# EAGLE design Core-Wemos (EAGLE 7.7.0)
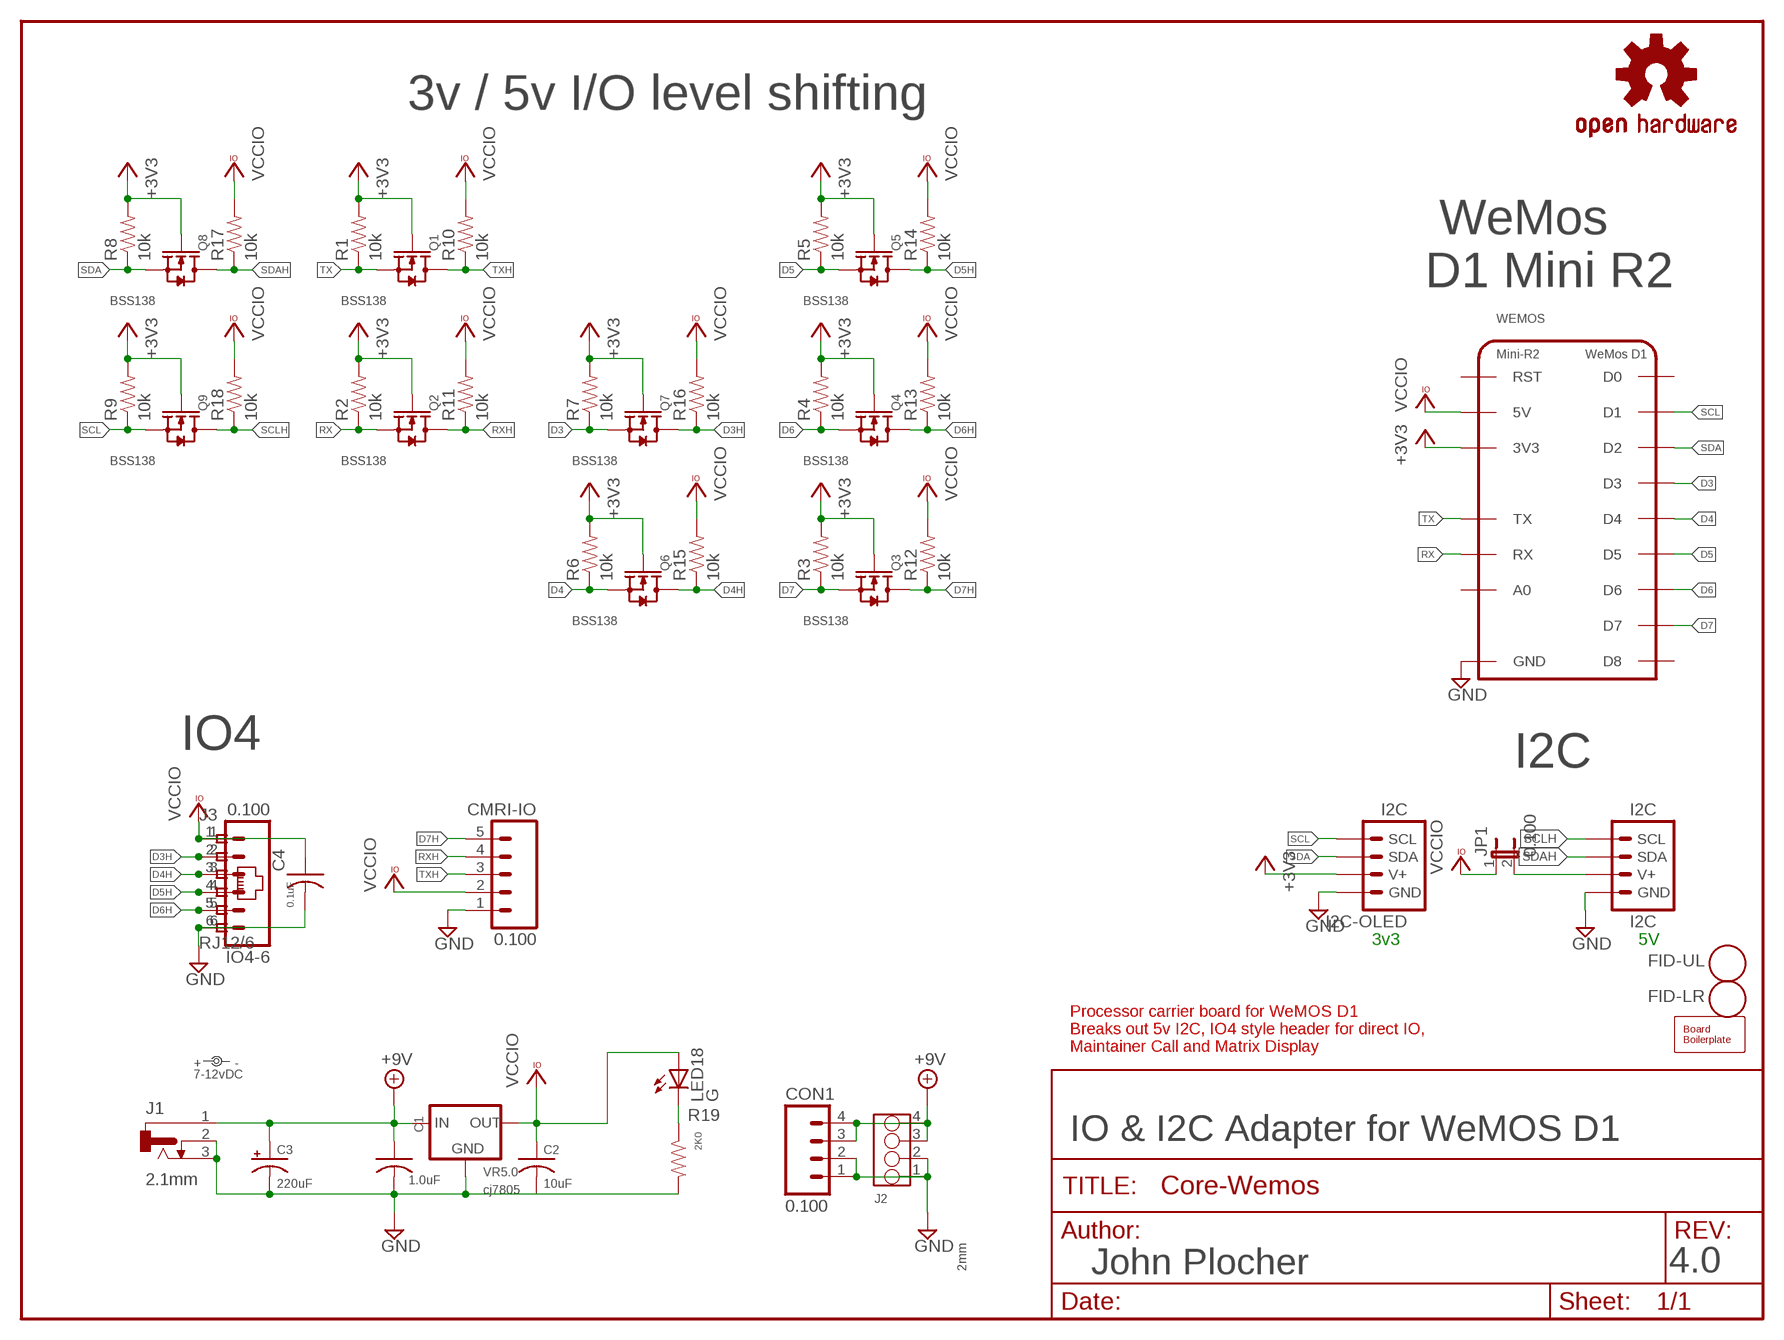
[diagram p0: schematic, sheet 1]

## Parts
BOARD  BOARD  BOARD80X80-NOHOLES  [BOARD-DINRAIL-3.17INX8CM-NOHOLES]
C1  1.0uF  CAP0603  [0603-CAP]
C2  10uF  CAP0603  [0603-CAP]
C3  220uF  CAP-POL0810  [0810-CAP]
C4  0.1uF  CAP0603  [0603-CAP]
CMRI-IO  0.100  CONNECTOR-M05CMRI  [1X05-CMRI-IO]
CON1  0.100  CONNECTOR-M04LOCK  [1X04_LOCK]
FID-LR  FIDUCIAL  [FIDUCIAL_1MM]
FID-UL  FIDUCIAL  [FIDUCIAL_1MM]
I2C  I2C  CONNECTOR-I2CLEFT  [I2C-L]
I2C-OLED  I2C  CONNECTOR-I2CNOOUTLINE  [I2C-NOOUTLINE]
IO4-6  0.100  CONNECTOR-M06LOCK  [1X06_LOCK]
J1  2.1mm  CONNECTOR-DC-POWER-RA  [DCJ0202]
J2  2mm  CONNECTOR-GROVE-4P-2.0-3470130P1  [4P-2.0]
J3  RJ12/6  CONNECTOR-RJ25-6P6C  [RJ25-PANEL]
JP1  0.100  JUMPER-2PTH_LOCK  [1X02_LOCK]
LABEL1  7-12vDC  DOC-POWER_LABEL  [PWR_LABEL]
LED18  G  LED0603-LED  [0603-LED]
OSHW1  OSHW  OSHW-LOGOL  [OSHW-LOGO-L]
Q1  BSS138  MOSFET-N-BSS138-SOT23  [SOT23]
Q2  BSS138  MOSFET-N-BSS138-SOT23  [SOT23]
Q3  BSS138  MOSFET-N-BSS138-SOT23  [SOT23]
Q4  BSS138  MOSFET-N-BSS138-SOT23  [SOT23]
Q5  BSS138  MOSFET-N-BSS138-SOT23  [SOT23]
Q6  BSS138  MOSFET-N-BSS138-SOT23  [SOT23]
Q7  BSS138  MOSFET-N-BSS138-SOT23  [SOT23]
Q8  BSS138  MOSFET-N-BSS138-SOT23  [SOT23]
Q9  BSS138  MOSFET-N-BSS138-SOT23  [SOT23]
R1  10k  R0603-RES  [0603-RES]
R2  10k  R0603-RES  [0603-RES]
R3  10k  R0603-RES  [0603-RES]
R4  10k  R0603-RES  [0603-RES]
R5  10k  R0603-RES  [0603-RES]
R6  10k  R0603-RES  [0603-RES]
R7  10k  R0603-RES  [0603-RES]
R8  10k  R0603-RES  [0603-RES]
R9  10k  R0603-RES  [0603-RES]
R10  10k  R0603-RES  [0603-RES]
R11  10k  R0603-RES  [0603-RES]
R12  10k  R0603-RES  [0603-RES]
R13  10k  R0603-RES  [0603-RES]
R14  10k  R0603-RES  [0603-RES]
R15  10k  R0603-RES  [0603-RES]
R16  10k  R0603-RES  [0603-RES]
R17  10k  R0603-RES  [0603-RES]
R18  10k  R0603-RES  [0603-RES]
R19  2K0  R0603-RES  [0603-RES]
VR5.0  cj7805  VREG-DPAK-5  [TO-252]
WEMOS  Mini-R2  WEMOS-D1V1  [WEMOS-D1]

## Nets
+3V3: I2C-OLED.V+ Q1.1(G) Q2.1(G) Q3.1(G) Q4.1(G) Q5.1(G) Q6.1(G) Q7.1(G) Q8.1(G) Q9.1(G) R1.2 R2.2 R3.2 R4.2 R5.2 R6.2 R7.2 R8.2 R9.2 WEMOS.3V3
+9V [Feed]: C1.1 C3.+ CON1.3 CON1.4 J1.1 J2.3 J2.4 VR5.0.1(IN)
D3 [signals]: Q7.2(S) R7.1 WEMOS.D3
D3H [signals]: IO4-6.2 J3.2 Q7.3(D) R16.1
D4 [signals]: Q6.2(S) R6.1 WEMOS.D4
D4H [signals]: IO4-6.3 J3.3 Q6.3(D) R15.1
D5 [signals]: Q5.2(S) R5.1 WEMOS.D5
D5H [signals]: IO4-6.4 J3.4 Q5.3(D) R14.1
D6 [signals]: Q4.2(S) R4.1 WEMOS.D6
D6H [signals]: IO4-6.5 J3.5 Q4.3(D) R13.1
D7 [signals]: Q3.2(S) R3.1 WEMOS.D7
D7H [signals]: CMRI-IO.5 Q3.3(D) R12.1
GND [signals]: C1.2 C2.2 C3.- C4.2 CMRI-IO.1 CON1.1 CON1.2 I2C-OLED.GND I2C.GND I2C.GND@1(GND) IO4-6.6 J1.2 J1.3 J2.1 J2.2 J3.6 VR5.0.2(GND) WEMOS.GND
GND1 [Power]: R19.2
N$1: LED18.C R19.1
N$44: I2C.V+ I2C.V+@1(V+) JP1.2
RX [signals]: Q2.2(S) R2.1 WEMOS.RX
RXH [signals]: CMRI-IO.4 Q2.3(D) R11.1
SCL [signals]: I2C-OLED.SCL Q9.2(S) R9.1 WEMOS.D1
SCLH [signals]: I2C.SCL I2C.SCL@1(SCL) Q9.3(D) R18.1
SDA [signals]: I2C-OLED.SDA Q8.2(S) R8.1 WEMOS.D2
SDAH [signals]: I2C.SDA I2C.SDA@1(SDA) Q8.3(D) R17.1
TX [signals]: Q1.2(S) R1.1 WEMOS.TX
TXH [signals]: CMRI-IO.3 Q1.3(D) R10.1
VCCIO [Power]: C2.1 C4.1 CMRI-IO.2 IO4-6.1 J3.1 JP1.1 LED18.A R10.2 R11.2 R12.2 R13.2 R14.2 R15.2 R16.2 R17.2 R18.2 VR5.0.3(OUT) WEMOS.5V
Unconnected: WEMOS.A0 WEMOS.D0 WEMOS.D8 WEMOS.RST

## Notes on the sheet
- 3v / 5v I/O level shifting
- WeMos
  D1 Mini R2
- IO4
- I2C
- 3v3 | 5V
- Processor carrier board for WeMOS D1
  Breaks out 5v I2C, IO4 style header for direct IO,
  Maintainer Call and Matrix Display
- IO & I2C Adapter for WeMOS D1
- John Plocher | 4.0

## Library data of the parts
BOARD = SPCoast:BOARD
C1 C2 C4 = SPCoast:CAP*
C3 = SPCoast:CAP-POL*
CMRI-IO = SPCoast:CONNECTOR-M05: Header 5 Standard 5-pin 0.1" header. Use with straight break away headers (SKU : PRT-00116), right angle break away headers (PRT-00553), swiss pins (PRT-00743), machine pins (PRT-00117), and female headers (PRT-00115). Molex polarized connector foot print use with SKU : PRT-08230 with associated crimp pins and housings.
CON1 = SPCoast:CONNECTOR-M04: Header 4 Standard 4-pin 0.1" header. Use with straight break away headers (SKU : PRT-00116), right angle break away headers (PRT-00553), swiss pins (PRT-00743), machine pins (PRT-00117), and female headers (PRT-00115). Molex polarized connector foot print use with SKU : PRT-08231 with associated crimp pins and housings. 1MM SMD Version SKU: PRT-10208
FID-LR FID-UL = SPCoast:FIDUCIAL: For use by pick and place machines to calibrate the vision/machine, 1mm By microbuilder.eu
I2C I2C-OLED = SPCoast:CONNECTOR-I2C
IO4-6 = SPCoast:CONNECTOR-M06: Header 6 Standard 6-pin 0.1" header
J1 = SPCoast:CONNECTOR-DC-POWER: DC POWER JACK
J2 = SPCoast:CONNECTOR-GROVE-4P-2.0
J3 = SPCoast:CONNECTOR-RJ25: AMP connector; AMP: 520250-3; OPL: none
JP1 = SPCoast:JUMPER-2: Jumper Basic 0.1" spaced jumper. Use with breakaway headers.
LABEL1 = SPCoast:DOC-POWER_LABEL
LED18 = SPCoast:LED*
OSHW1 = SparkFun:OSHW-LOGO: Open Source Hardware Logo This logo indicates the piece of hardware it is found on incorporates a OSHW license and/or adheres to the definition of open source hardware found here: http://freedomdefined.org/OSHW
Q1-Q9 = SPCoast:MOSFET-N-*-?: CJ2302：SMD MOSFET N-CH 20V-2.1A DMN4468 - SO8 30v/10A
R1-R19 = SPCoast:R*: Resistor Basic schematic elements and footprints for 0603, 1206, and PTH 1/10th watt (small) resistors.
VR5.0 = SPCoast:VREG-?-*: Voltage Regulator Standard linear regulator. 7805 uses IGO pinout LM1117 uses GOI pinout
WEMOS = SPCoast:WEMOS-D1

## Net classes
0 default: width 0.254 mm, drill 0.5 mm, clearance 0.203 mm
1 Power: width 0.406 mm, drill 0.8 mm, clearance 0.254 mm
2 signals: width 0.254 mm, drill 0.6 mm, clearance 0.254 mm
3 Feed: width 1.016 mm, drill 1.4 mm, clearance 0.254 mm

## Board
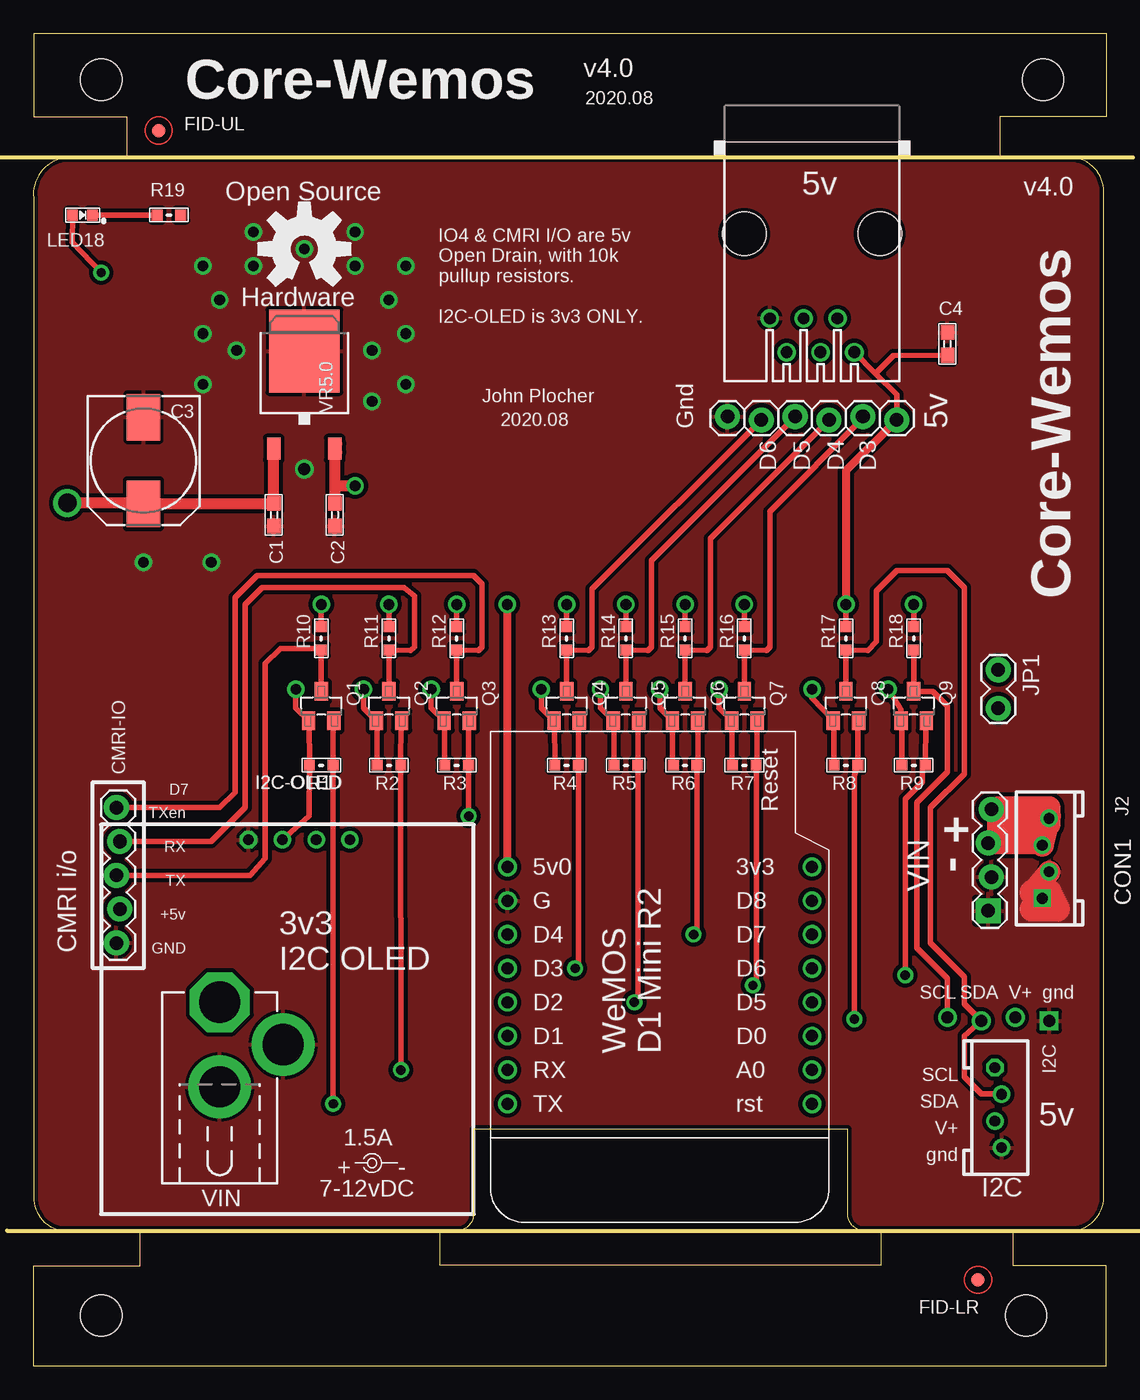
[diagram p1: board, top side]
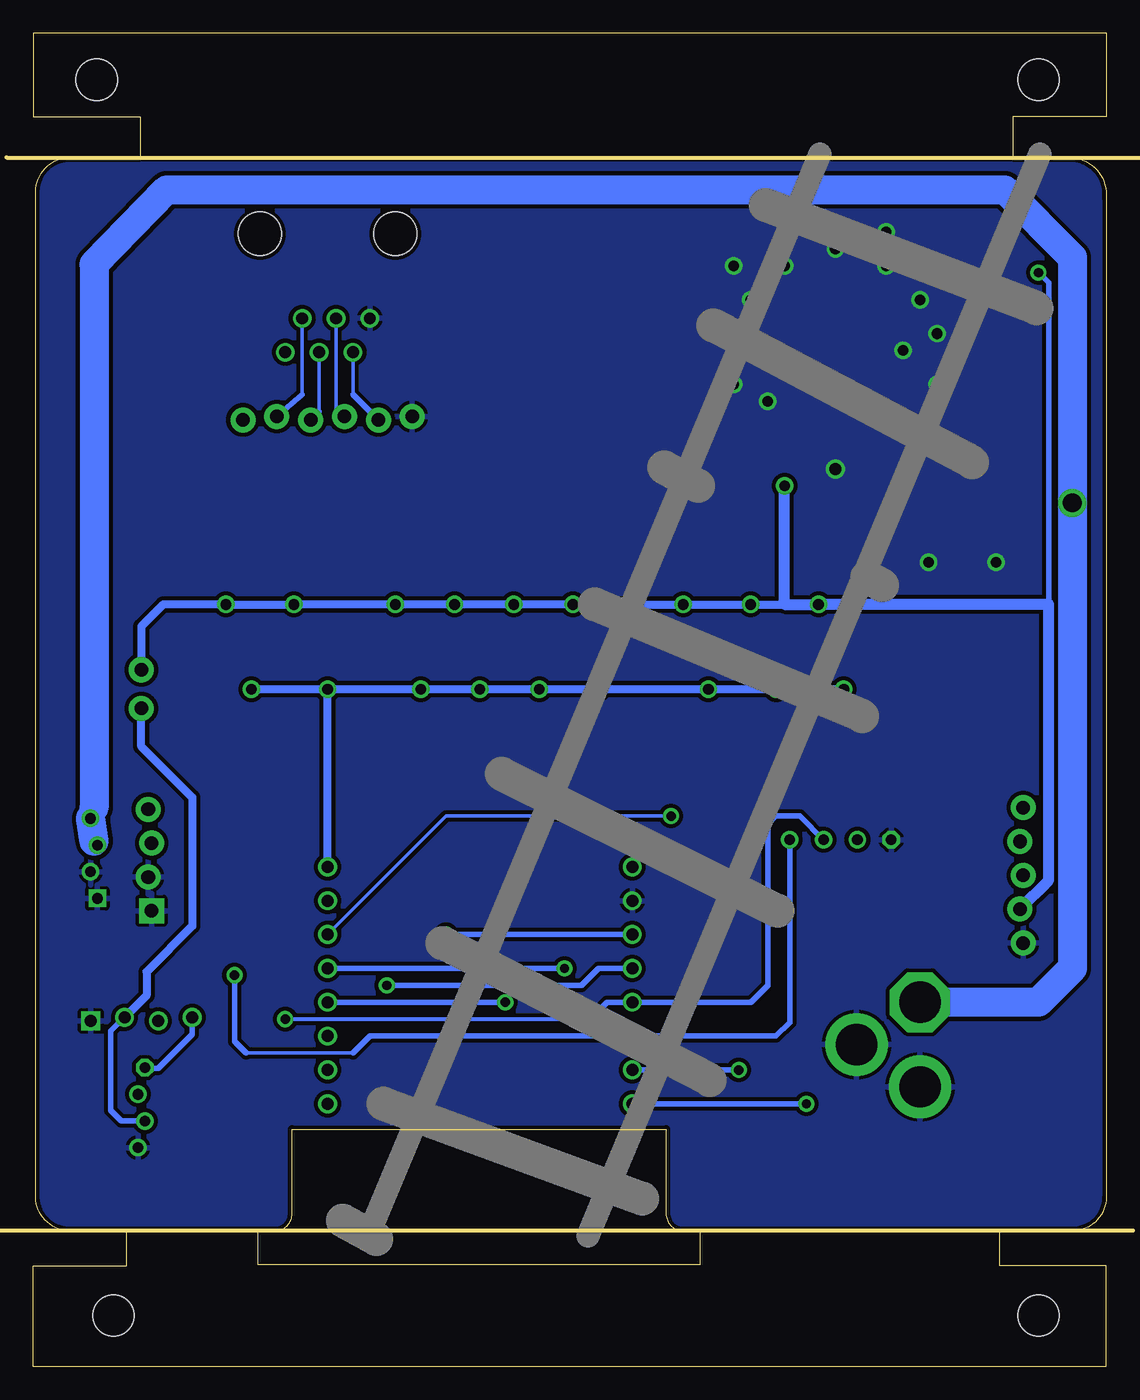
[diagram p2: board, bottom side, seen from below]

Size 80.51 x 100 mm. Coordinates in mm from the lower left corner, seen from the top.
Outline: 33.03,17.78 33.03,11.43 arc-90 31.76,10.16 30.49,10.16 30.49,7.62 63.64,7.62 63.64,10.16 62.37,10.16 arc-90 61.1,11.43 61.1,17.78 33.03,17.78
Copper layers (1*16): Top 0.035mm / dielectric 1.5mm / Bottom 0.035mm
Design rules "Fusion_eagle_rule_v1.1 *": minimum track width 8mil, minimum drill 0.6mm, track to track 6mil, track to pad 6mil, pad to pad 10mil, via to via 10mil, smd to smd 10mil, copper to edge 10mil, drill to drill 10mil, minimum pad ring 10mil, minimum via ring 10mil, stop-mask expansion 2mil, vias tented up to drill 100mil, thermal gap 10mil

### Footprints (pad centres in the part's own frame; a part is rotated, then mirrored left to right if it is on the bottom)
BOARD-DINRAIL-3.17INX8CM-NOHOLES = hole 3.1: 5.08,96.52; 75.75,96.52; 5.08,3.81; 74.48,3.81
0603-CAP = smd 1.1 x 1: 1 -0.85,0; 2 0.85,0
0810-CAP = smd 3.5 x 2.5: + 3.25,0; - -3.25,0
1X05-CMRI-IO = drill 1.016 pad 1.88: 1 0,0.127; 2 2.54,-0.127; 3 5.08,0.127; 4 7.62,-0.127; 5 10.16,0.127
1X04_LOCK = drill 1.016 pad 1.88 square: 1 0,0.127 | drill 1.016 pad 1.88: 2 2.54,-0.127; 3 5.08,0.127; 4 7.62,-0.127
FIDUCIAL_1MM = smd 1 x 1: 1 0,0
I2C-L = drill 0.9 square: GND 3.81,-0.127 | drill 0.8 pad 1.27: GND@1 0.254,-9.635; SDA@1 0.254,-5.635; V+@1 -0.254,-7.635 | drill 0.9: SCL -3.81,0.127; SDA -1.27,-0.127; V+ 1.27,0.127 | drill 0.8 pad 1.27 octagon: SCL@1 -0.254,-3.635
I2C-NOOUTLINE = drill 0.8 octagon: GND 3.81,0 | drill 0.8: SCL -3.81,0; SDA -1.27,0; V+ 1.27,0
1X06_LOCK = drill 1.016 pad 1.88: 1 0,0; 2 2.54,-0.254; 3 5.08,0; 4 7.62,-0.254; 5 10.16,0; 6 12.7,-0.254
DCJ0202 = drill 3.1 pad 4.5 octagon: 1 0,3.175 | drill 3.1 pad 4.7: 2 4.763,0; 3 0,-3.175
4P-2.0 = drill 0.8 pad 1.27 square: 1 -3,0.254 | drill 0.8 pad 1.27: 2 -1,-0.254; 3 1,0.254; 4 3,-0.254
RJ25-PANEL = drill 0.889: 1 -3.175,8.89; 2 -1.905,6.35; 3 -0.635,8.89; 4 0.635,6.35; 5 1.905,8.89; 6 3.175,6.35 | hole 3.251: -5.08,0; 5.08,0
1X02_LOCK = drill 1.016 pad 1.88: 1 -0.178,0; 2 2.718,0
0603-LED = smd 0.8 x 0.8: A 0.75,0; C -0.75,0
SOT23 = smd 1.4 x 1: 1 1.1,-0.95; 2 1.1,0.95; 3 -1.1,0
0603-RES = smd 0.813 x 0.813: 1 -0.889,0; 2 0.889,0
TO-252 = smd 1.651 x 1.016: 1 -4.826,2.286; 3 -4.826,-2.286 | smd 6.2 x 5.3: 2 2.5,0
WEMOS-D1 = drill 0.9: 3V3 -11.43,-7.62; 5V 11.43,-7.62; A0 -11.43,7.62; D0 -11.43,5.08; D1 11.43,5.08; D2 11.43,2.54; D3 11.43,0; D4 11.43,-2.54; D5 -11.43,2.54; D6 -11.43,0; D7 -11.43,-2.54; D8 -11.43,-5.08; GND 11.43,-5.08; RST -11.43,10.16; RX 11.43,7.62; TX 11.43,10.16

### Placement (x,y rotation side)
BOARD  0.01,0 0 top
C1  18.05,63.88 270 top
C2  22.62,63.88 270 top
C3  8.27,67.94 270 top
C4  68.59,76.71 90 top
CMRI-IO  6.36,31.75 90 top
CON1  71.77,34.16 90 top
FID-LR  70.88,6.48 0 top
FID-UL  9.41,92.71 0 top
I2C  72.4,26.04 0 top
I2C-OLED  19.95,39.5 180 top
IO4-6  64.78,70.99 180 top
J1  13.98,24.13 0 top
J2  75.96,38.1 90 top
J3  58.43,84.96 180 top
JP1  72.4,52.07 270 top
LABEL1  25.41,15.24 90 top
LED18  3.7,86.36 180 top
OSHW1  20.33,83.82 0 top
Q1  21.6,49.53 270 top
Q2  26.68,49.53 270 top
Q3  31.76,49.53 270 top
Q4  40.02,49.53 270 top
Q5  44.46,49.53 270 top
Q6  48.91,49.53 270 top
Q7  53.35,49.53 270 top
Q8  60.97,49.53 270 top
Q9  66.05,49.53 270 top
R1  21.6,45.09 180 top
R2  26.68,45.09 180 top
R3  31.76,45.09 180 top
R4  40.02,45.09 180 top
R5  44.46,45.09 180 top
R6  48.91,45.09 180 top
R7  53.35,45.09 180 top
R8  60.97,45.09 180 top
R9  66.05,45.09 180 top
R10  21.6,54.61 90 top
R11  26.68,54.61 90 top
R12  31.76,54.61 90 top
R13  40.02,54.61 90 top
R14  44.46,54.61 90 top
R15  48.91,54.61 90 top
R16  53.35,54.61 90 top
R17  60.97,54.61 90 top
R18  66.05,54.61 90 top
R19  10.17,86.36 0 top
VR5.0  20.33,73.66 90 top
WEMOS  47,29.84 180 top

### Tracks (layer width: path | path; a pad name or v marks a point on that pad's centre or on a via)
+3V3  (via drill 0.8)
  Top 0.254: 20.7,48.38 Q1.1 | 25.78,48.38 Q2.1 | 30.86,48.38 Q3.1 | 60.07,48.38 Q8.1 | 65.15,48.38 Q9.1
  Top 0.406: R6.2 47.96,45.13 Q6.1 47,49.38 v47,50.8 | R7.2 52.4,45.13 Q7.1 51.45,49.38 v51.45,50.8 | 20.7,48.38 R1.2 20.7,41.29 I2C-OLED.V+ | R2.2 25.78,48.38 | R3.2 30.86,48.38 | R4.2 39.12,48.38 Q4.1 38.11,49.38 v38.11,50.8 | R5.2 43.56,48.38 Q5.1 42.56,49.38 v42.56,50.8 | R8.2 60.07,48.38 | R9.2 65.15,48.38 | Q1.1 19.7,49.38 v19.7,50.8 | Q2.1 24.78,49.38 v24.78,50.8 | Q3.1 29.86,49.38 v29.86,50.8 | Q8.1 58.43,50.15 v58.43,50.8 | Q9.1 65.09,49.28 v64.15,50.8
  Bottom 0.61: v64.15,50.8 v58.43,50.8 | v19.7,50.8 v24.78,50.8 v29.86,50.8 v38.11,50.8 v42.56,50.8 v47,50.8 v51.45,50.8 v58.43,50.8 | WEMOS.3V3 v58.43,50.8
+9V  (via drill 1.4)
  Top 0.61: C3.+ 8.19,64.77 | 18.05,64.69 C1.1
  Top 0.813: 18.05,64.69 C3.+ | 8.19,64.77 v2.55,64.77 | C1.1 VR5.0.1
  Top 1.676: CON1.3 72.4,39.24 | 72.4,39.24 75.71,39.24 J2.3 | CON1.4 72.4,41.78 | 72.4,41.78 72.4,39.24 | 72.4,41.78 73.67,41.78 73.67,40.64 76.21,40.64 76.21,41.91 72.4,41.91
  Top 1.778: J2.3 76.21,41.27
  Bottom 1.016: 75.96,39.37 J2.3
  Bottom 1.422: 75.96,41.91 76.09,41.78 J2.4
  Bottom 2.184: 75.96,39.37 J2.4 | J1.1 5.09,27.3 2.55,29.84 v2.55,64.77 2.55,83.19 7.63,88.27 70.5,88.27 75.96,82.68 75.96,41.91
D3  (via drill 0.7)
  Top 0.406: Q7.2 54.3,45.13 R7.1 54.25,28.84 v53.99,28.57
  Bottom 0.406: WEMOS.D3 38.11,29.84 39.38,28.57 v53.99,28.57
D3H
  Top 0.406: Q7.3 R16.1 54.99,53.71 55.26,53.98 55.26,64.14 62.24,71.12 IO4-6.2
  Bottom 0.254: J3.2 60.34,72.9
  Bottom 0.406: 60.34,72.9 IO4-6.2
D4  (via drill 0.7)
  Top 0.406: Q6.2 49.86,45.13 R6.1 49.81,32.65 v49.54,32.38
  Bottom 0.406: WEMOS.D4 v49.54,32.38
D4H
  Top 0.406: Q6.3 R15.1 50.55,53.71 50.81,53.98 50.81,62.1 IO4-6.3
  Bottom 0.254: J3.3 59.07,71.63
  Bottom 0.406: 59.07,71.63 IO4-6.3
D5  (via drill 0.7)
  Top 0.406: Q5.2 45.36,48.38 R5.1 45.36,27.57 v45.1,27.3
  Bottom 0.406: WEMOS.D5 v45.1,27.3
D5H
  Top 0.406: Q5.3 R14.1 46.1,53.71 46.37,53.98 46.37,60.45 IO4-6.4
  Bottom 0.254: J3.4 57.8,71.63
  Bottom 0.406: 57.8,71.63 IO4-6.4
D6  (via drill 0.7)
  Top 0.406: Q4.2 40.92,48.38 R4.1 40.92,30.11 v40.65,29.84
  Bottom 0.406: WEMOS.D6 v40.65,29.84
D6H
  Top 0.406: Q4.3 R13.1 41.66,53.71 41.92,53.98 41.92,58.29 IO4-6.5
  Bottom 0.254: J3.5 56.53,72.9
  Bottom 0.406: 56.53,72.9 IO4-6.5
D7  (via drill 0.7)
  Top 0.254: 32.66,48.38 Q3.2
  Top 0.406: 32.66,48.38 R3.1 v32.66,41.27
  Bottom 0.254: WEMOS.D7 49.54,41.27 v32.66,41.27
D7H
  Top 0.406: Q3.3 R12.1 33.4,53.71 33.67,53.98 33.67,58.67 33.03,59.31 16.78,59.31 15.13,57.66 15.13,43.05 13.98,41.91 CMRI-IO.5
GND  (via drill 0.8, 0.9)
  Top 1.676: J2.2 74.94,35.56
  Top 1.93: 74.94,35.56 76.21,35.56 76.85,34.29 74.94,34.29
  other vias: 25.41,72.39 25.41,76.2 26.68,80.01 15.25,76.2 13.98,80.01 24.14,85.09 16.52,85.09 27.95,77.47 12.71,77.47 27.95,73.66 12.71,82.55 27.95,82.55 16.52,82.55 24.14,82.55 20.33,83.82 12.71,73.66 8.27,60.33 13.35,60.33 20.33,67.31
  pour Bottom (isolate 0.305, rank 2): 81.29,10.67 81.29,90.17 0.01,90.17 0.01,10.67 33.03,10.67 33.03,17.78 61.1,17.78 61.1,10.67
  pour Top (isolate 0.305, rank 2): 81.29,10.67 81.29,90.17 0.01,90.17 0.01,10.67 33.03,10.67 33.03,17.78 61.1,17.78 61.1,10.67
N$1
  Top 0.406: LED18.C R19.1
N$44
  Bottom 0.406: I2C.V+ 74.69,25.15 74.69,19.18 73.91,18.4 I2C.V+@1
  Bottom 0.61: I2C.V+ 72.02,27.81 72.02,29.59 68.59,33.02 68.59,42.67 72.4,46.48 JP1.2
RX  (via drill 0.7)
  Top 0.254: 27.58,48.38 Q2.2
  Top 0.406: 27.58,48.38 R2.1 v27.58,22.23
  Bottom 0.406: WEMOS.RX v27.58,22.23
RXH
  Top 0.406: Q2.3 R11.1 28.32,53.71 28.59,53.98 28.59,57.78 27.83,58.42 17.16,58.42 15.89,57.15 15.89,41.91 13.35,39.37 CMRI-IO.4
SCL  (via drill 0.7)
  Top 0.254: 66.95,48.38 Q9.2
  Top 0.406: 66.95,48.38 R9.1 66.69,45.09 66.69,43.81 65.42,42.55 v65.42,29.34
  Bottom 0.254: 56.53,23.5 64.53,23.5
  Bottom 0.406: 56.53,23.5 55.26,24.77 WEMOS.D1 24.78,24.77 23.76,25.78 I2C-OLED.SCL | 64.53,23.5 65.42,24.38 v65.42,29.34
SCLH
  Top 0.254: 68.47,26.16 I2C.SCL
  Top 0.406: R18.1 Q9.3 67.49,50.63 68.59,49.53 68.59,44.58 66.31,42.29 66.31,31.37 68.59,29.08 68.59,26.42 68.47,26.16
  Bottom 0.406: I2C.SCL 68.59,24.89 71.13,22.35 72.1,22.35 I2C.SCL@1
SDA  (via drill 0.7)
  Top 0.254: 61.87,48.38 Q8.2
  Top 0.406: 61.87,48.38 R8.1 61.61,44.33 v61.61,26.04
  Bottom 0.254: WEMOS.D2 36.08,27.3
  Bottom 0.305: 38.75,26.04 v61.61,26.04
  Bottom 0.406: 38.75,26.04 37.48,27.3 36.08,27.3 26.68,27.3 25.41,28.57 25.41,40.64 24.78,41.27 23,41.27 I2C-OLED.SDA
SDAH
  Top 0.406: Q8.3 R17.1 62.61,53.71 63.26,54.36 63.26,58.17 64.78,59.69 68.59,59.69 69.86,58.42 69.86,44.45 67.32,41.91 67.32,31.75 69.86,29.21 69.86,27.18 I2C.SDA 69.86,24.77 69.86,21.72 71.13,20.45 72.61,20.45 I2C.SDA@1
TX  (via drill 0.7)
  Top 0.254: 22.5,48.38 Q1.2
  Top 0.406: 22.5,48.38 R1.1 v22.5,19.68
  Bottom 0.406: WEMOS.TX v22.5,19.68
TXH
  Top 0.406: Q1.3 R10.1 21.47,53.85 18.56,53.85 17.41,52.7 17.41,38.1 16.27,36.83 CMRI-IO.3
VCCIO  (via drill 0.7, 0.8)
  Top 0.406: R15.2 v48.91,57.15 | R10.2 v21.6,57.15 | R11.2 v26.68,57.15 | R12.2 v31.76,57.15 | R16.2 v53.35,57.15 | R13.2 v40.02,57.15 | R14.2 v44.46,57.15 | R17.2 v60.97,57.15 | R18.2 v66.05,57.15 | IO4-6.1 64.78,72.9 63.2,74.49 | 63.2,74.49 J3.1 | C4.1 64.52,75.81 63.2,74.49 | v5.09,82.04 2.93,84.33 LED18.A
  Top 0.61: 22.87,69.22 VR5.0.3 22.87,68.58 22.62,68.58 | WEMOS.5V v35.57,57.15 | IO4-6.1 60.97,67.18 v60.97,57.15
  Top 0.813: 22.62,68.58 22.62,66.04 | 22.62,66.04 C2.1 | v24.14,66.04 22.62,66.04
  Bottom 0.406: 4.33,57.15 4.33,81.28 v5.09,82.04
  Bottom 0.61: 24.14,57.15 v26.68,57.15 v31.76,57.15 v35.57,57.15 v40.02,57.15 v44.46,57.15 v48.91,57.15 v53.35,57.15 v60.97,57.15 v66.05,57.15 70.75,57.15 72.4,55.5 JP1.1
  Bottom 0.813: CMRI-IO.2 4.33,36.45 4.33,57.15 v21.6,57.15 24.14,57.15 v24.14,66.04

### Text on the board
tPlace: v4.0 | 2020.08 | 5v | v4.0 | Open Source | Hardware | IO4 & CMRI I/O are 5v / Open Drain, with 10k / pullup resistors. / / I2C-OLED is 3v3 ONLY. | John Plocher | 2020.08 | Gnd | 5v | D6 | D5 | D4 | D3 | D7 | I2C OLED | + - | VIN | CMRI i/o | 3v3 / I2C OLED | WeMOS / D1 Mini R2 | 5v | 1.5A | VIN
bDocu: Made in the PCR, Coast Division, NMRA | For use with WeMOS D1 ESP8266 | CMRInet Interface, / IO4 breakout, and / I2C master | Go Bears! | Core WeMOS / D1 Mini | Model Railroading is fun! | www. SP Coast .com